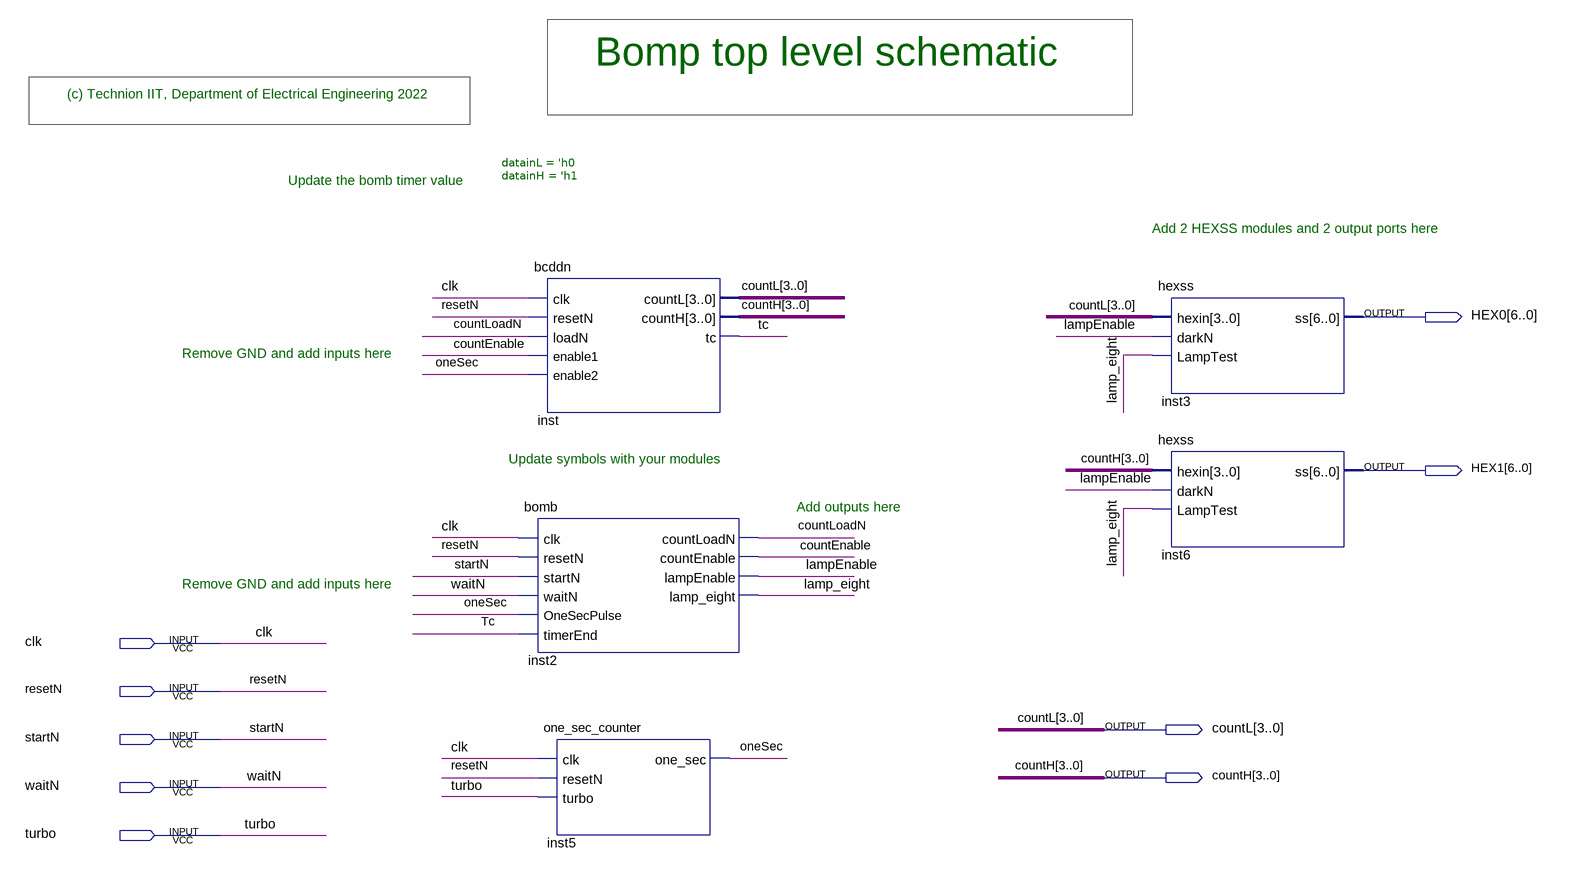
[diagram p0: schematic sheet]
// Quartus schematic topBomb.bdf as structural Verilog: 5 symbols, 9 pins
module topBomb (
  input  clk,
  input  resetN,
  input  startN,
  input  waitN,
  input  turbo,
  output [6:0] HEX0,
  output [6:0] HEX1,
  output [3:0] countL,
  output [3:0] countH
);

  wire countEnable, countLoadN, lamp_eight, lampEnable, oneSec, tc;

  bomb inst2 (
    .clk(clk), .resetN(resetN), .startN(startN), .waitN(waitN), .OneSecPulse(oneSec), .timerEnd(tc),
    .countLoadN(countLoadN), .countEnable(countEnable), .lampEnable(lampEnable), .lamp_eight(lamp_eight));
  bcddn #(.datainL('h0), .datainH('h1)) inst (
    .clk(clk), .resetN(resetN), .loadN(countLoadN), .enable1(countEnable), .enable2(oneSec), .countL(countL),
    .countH(countH), .tc(tc));
  one_sec_counter inst5 (.clk(clk), .resetN(resetN), .turbo(turbo), .one_sec(oneSec));
  hexss inst3 (.hexin(countL), .darkN(lampEnable), .LampTest(lamp_eight), .ss(HEX0));
  hexss inst6 (.hexin(countH), .darkN(lampEnable), .LampTest(lamp_eight), .ss(HEX1));

  // Notes on the sheet:
  //   Bomp top level schematic 
  //   (c) Technion IIT, Department of Electrical Engineering 2022 
  //   Update the bomb timer value
  //   Add 2 HEXSS modules and 2 output ports here
  //   Remove GND and add inputs here
  //   Update symbols with your modules
  //   Add outputs here
  //   Remove GND and add inputs here
endmodule
